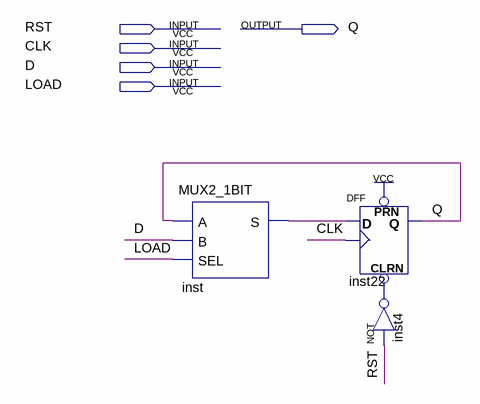
[diagram p0: schematic sheet]
// Quartus schematic REG_1BIT.bdf as structural Verilog: 3 symbols, 5 pins
module REG_1BIT (
  input  RST,
  input  CLK,
  input  D,
  input  LOAD,
  output Q
);

  wire inst4_out, inst_s;

  MUX2_1BIT inst (.A(Q), .B(D), .SEL(LOAD), .S(inst_s));
  DFF inst22 (.CLRN(inst4_out), .CLK(CLK), .D(inst_s), .PRN(1'b1), .Q(Q));
  not inst4 (inst4_out, RST);
endmodule
